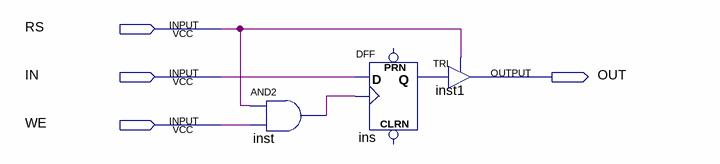
[diagram p0: schematic sheet]
// Quartus schematic Memory_Cell.bdf as structural Verilog: 3 symbols, 4 pins
module Memory_Cell (
  input  RS,
  input  IN,
  input  WE,
  output OUT
);

  wire ins_q, inst_out;

  and inst (inst_out, RS, WE);
  DFF ins (.CLK(inst_out), .D(IN), .Q(ins_q));  // open: CLRN, PRN
  TRI inst1 (.IN(ins_q), .OE(RS), .OUT(OUT));
endmodule
